# Altium schematic sheet Master.SchDoc: QUTMS Shutdown V2 - Master
size A3; Organization: QUT Motorsport; Address1: O-120; Address2: O Block; Address3: QUT Gardnes Point; Address4: Brisbane, 4000; DocumentNumber: 1; SheetNumber: 1; SheetTotal: 13
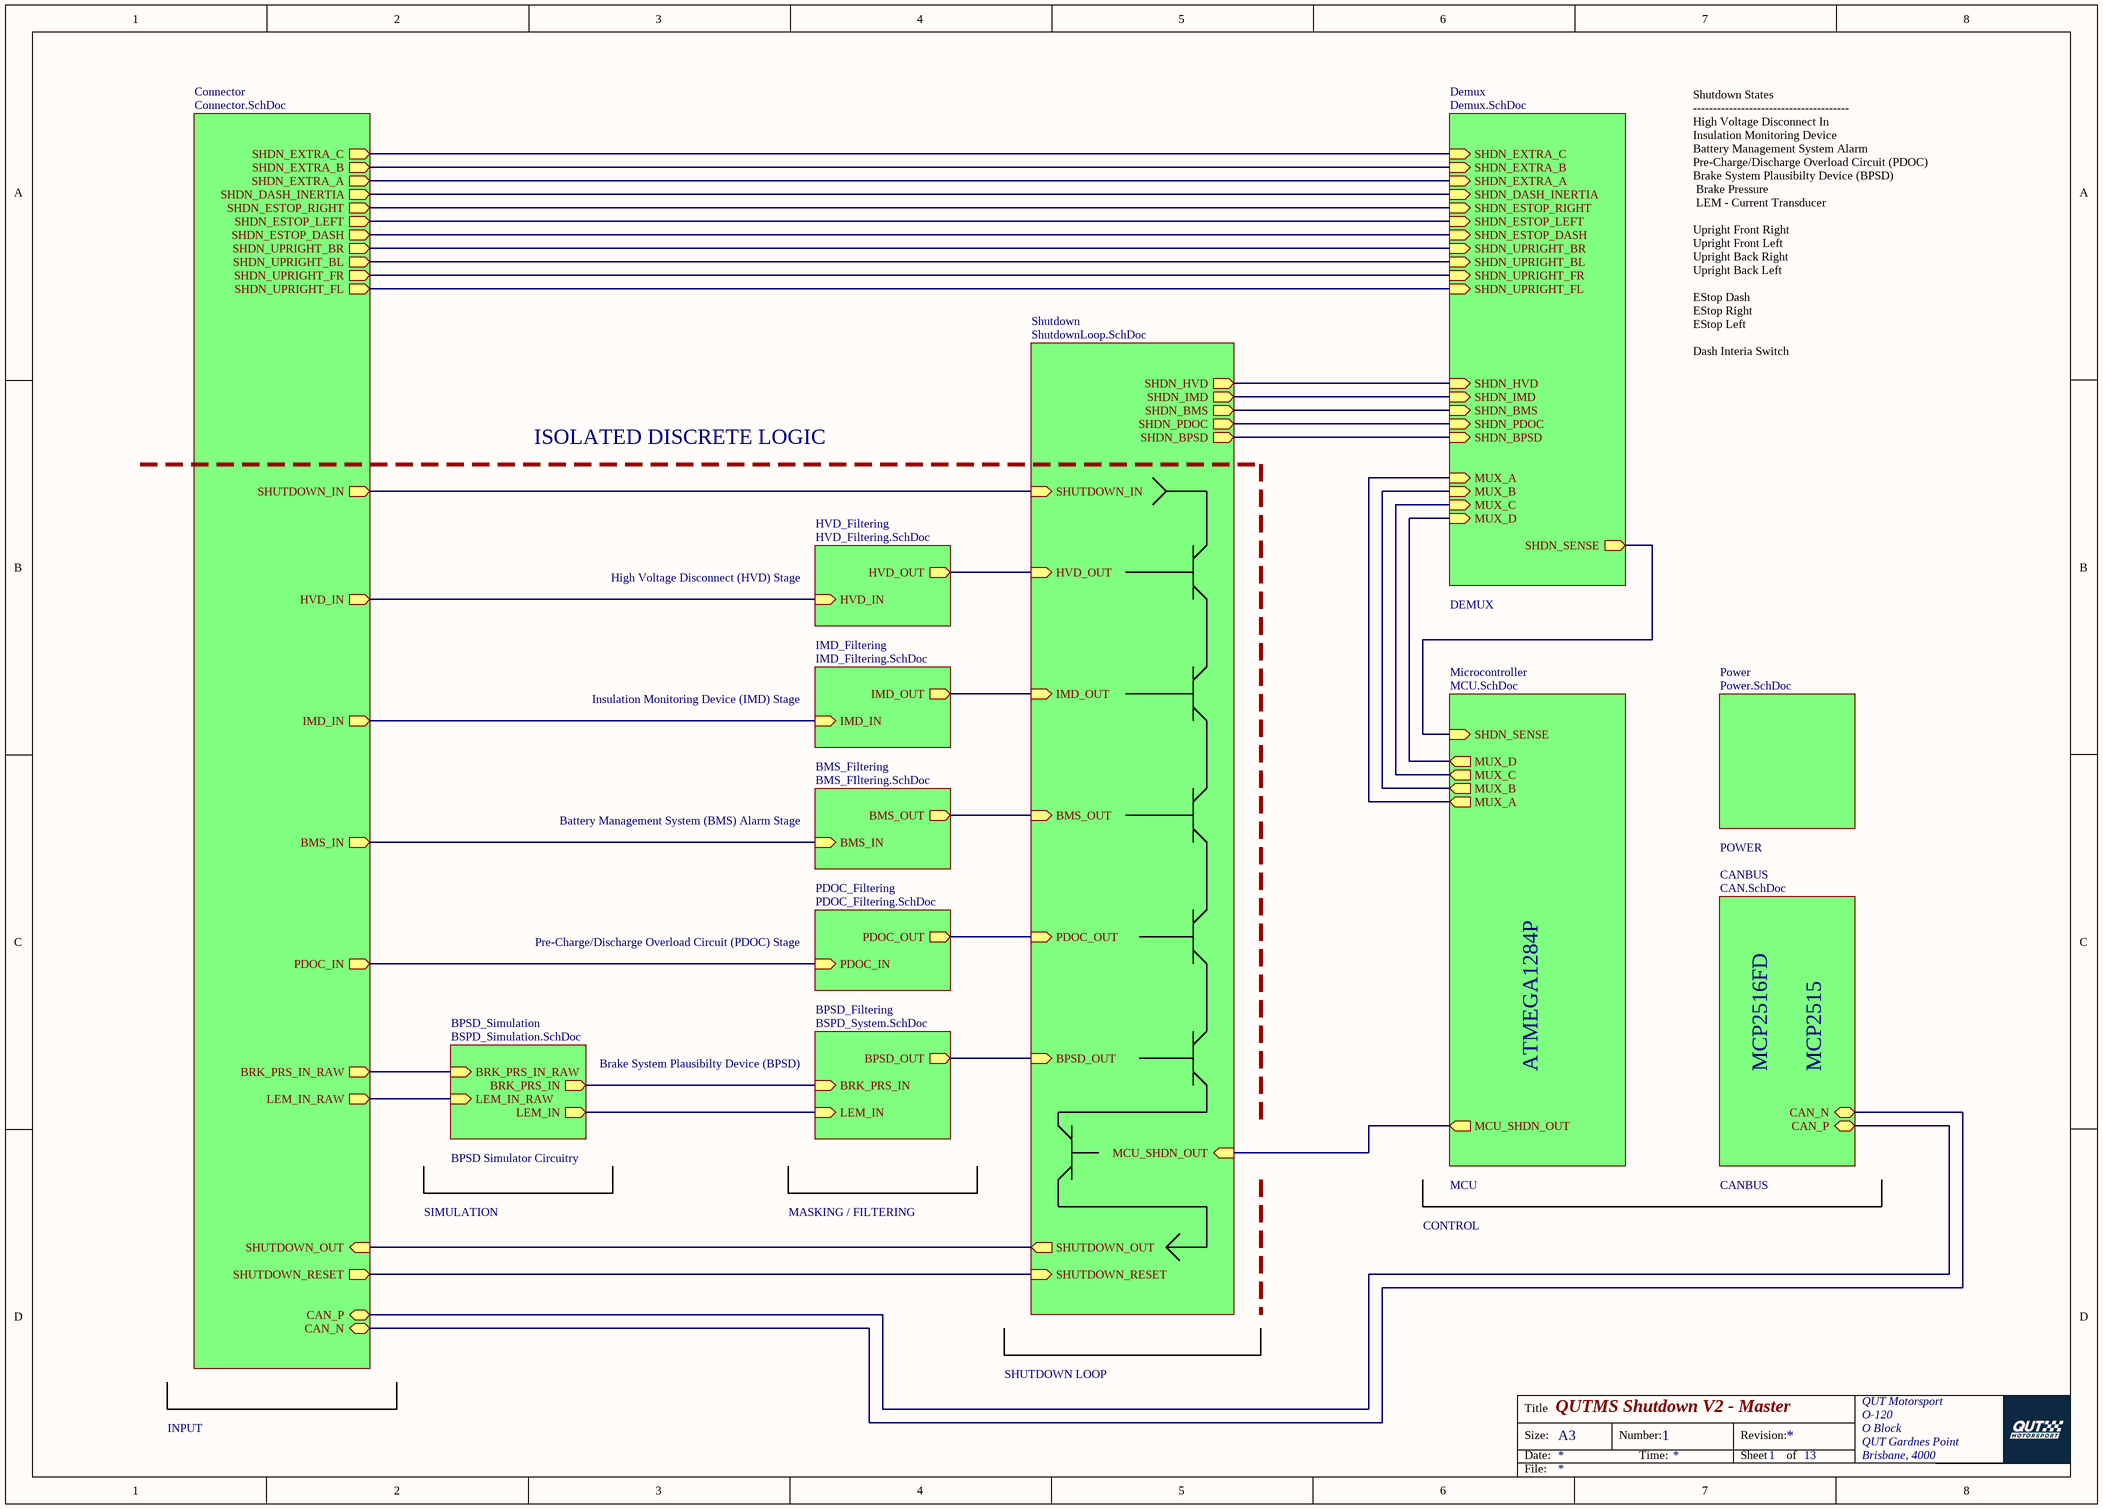
[diagram p0: Master.SchDoc]

## Sub-sheets
BMS_Filtering = BMS_FIltering.SchDoc: BMS_OUT (out), BMS_IN (in)
BPSD_Filtering = BSPD_System.SchDoc: BPSD_OUT (out), BRK_PRS_IN (in), LEM_IN (in)
BPSD_Simulation = BSPD_Simulation.SchDoc: LEM_IN (out), BRK_PRS_IN (out), BRK_PRS_IN_RAW (in), LEM_IN_RAW (in)
CANBUS = CAN.SchDoc: CAN_P (bidir), CAN_N (bidir)
Connector = Connector.SchDoc: LEM_IN_RAW (out), BRK_PRS_IN_RAW (out), PDOC_IN (out), BMS_IN (out), IMD_IN (out), HVD_IN (out), SHUTDOWN_IN (out), SHUTDOWN_OUT (in), SHUTDOWN_RESET (out), SHDN_UPRIGHT_FL (out), SHDN_UPRIGHT_FR (out), SHDN_UPRIGHT_BL (out), SHDN_UPRIGHT_BR (out), SHDN_ESTOP_LEFT (out), SHDN_ESTOP_RIGHT (out), SHDN_DASH_INERTIA (out), SHDN_EXTRA_B (out), SHDN_EXTRA_A (out), SHDN_ESTOP_DASH (out), SHDN_EXTRA_C (out), CAN_N (bidir), CAN_P (bidir)
Demux = Demux.SchDoc: SHDN_EXTRA_C (in), SHDN_EXTRA_B (in), SHDN_EXTRA_A (in), SHDN_DASH_INERTIA (in), SHDN_ESTOP_RIGHT (in), SHDN_ESTOP_LEFT (in), SHDN_ESTOP_DASH (in), SHDN_UPRIGHT_BR (in), SHDN_UPRIGHT_BL (in), SHDN_UPRIGHT_FR (in), SHDN_UPRIGHT_FL (in), SHDN_HVD (in), SHDN_IMD (in), SHDN_BMS (in), SHDN_PDOC (in), SHDN_BPSD (in), SHDN_SENSE (out), MUX_D (in), MUX_C (in), MUX_B (in), MUX_A (in)
HVD_Filtering = HVD_Filtering.SchDoc: HVD_OUT (out), HVD_IN (in)
IMD_Filtering = IMD_Filtering.SchDoc: IMD_OUT (out), IMD_IN (in)
Microcontroller = MCU.SchDoc: SHDN_SENSE (in), MUX_D (out), MUX_C (out), MUX_B (out), MUX_A (out), MCU_SHDN_OUT (out)
PDOC_Filtering = PDOC_Filtering.SchDoc: PDOC_OUT (out), PDOC_IN (in)
Power = Power.SchDoc: no entries
Shutdown = ShutdownLoop.SchDoc: HVD_OUT (in), IMD_OUT (in), BMS_OUT (in), PDOC_OUT (in), BPSD_OUT (in), SHUTDOWN_IN (in), SHUTDOWN_OUT (out), SHUTDOWN_RESET (in), SHDN_HVD (out), SHDN_IMD (out), SHDN_BMS (out), SHDN_PDOC (out), SHDN_BPSD (out), MCU_SHDN_OUT (in)

## Nets
(unnamed): sheet HVD_Filtering/HVD_OUT, sheet Shutdown/HVD_OUT
(unnamed): sheet HVD_Filtering/HVD_IN, sheet Connector/HVD_IN
(unnamed): sheet IMD_Filtering/IMD_OUT, sheet Shutdown/IMD_OUT
(unnamed): sheet IMD_Filtering/IMD_IN, sheet Connector/IMD_IN
(unnamed): sheet BMS_Filtering/BMS_OUT, sheet Shutdown/BMS_OUT
(unnamed): sheet BMS_Filtering/BMS_IN, sheet Connector/BMS_IN
(unnamed): sheet PDOC_Filtering/PDOC_OUT, sheet Shutdown/PDOC_OUT
(unnamed): sheet PDOC_Filtering/PDOC_IN, sheet Connector/PDOC_IN
(unnamed): sheet BPSD_Filtering/BPSD_OUT, sheet Shutdown/BPSD_OUT
(unnamed): sheet BPSD_Filtering/BRK_PRS_IN, sheet BPSD_Simulation/BRK_PRS_IN
(unnamed): sheet BPSD_Filtering/LEM_IN, sheet BPSD_Simulation/LEM_IN
(unnamed): sheet BPSD_Simulation/BRK_PRS_IN_RAW, sheet Connector/BRK_PRS_IN_RAW
(unnamed): sheet BPSD_Simulation/LEM_IN_RAW, sheet Connector/LEM_IN_RAW
(unnamed): sheet Connector/SHUTDOWN_IN, sheet Shutdown/SHUTDOWN_IN
(unnamed): sheet Connector/SHUTDOWN_OUT, sheet Shutdown/SHUTDOWN_OUT
(unnamed): sheet Connector/SHUTDOWN_RESET, sheet Shutdown/SHUTDOWN_RESET
(unnamed): sheet Connector/SHDN_UPRIGHT_FL, sheet Demux/SHDN_UPRIGHT_FL
(unnamed): sheet Connector/SHDN_UPRIGHT_FR, sheet Demux/SHDN_UPRIGHT_FR
(unnamed): sheet Connector/SHDN_UPRIGHT_BL, sheet Demux/SHDN_UPRIGHT_BL
(unnamed): sheet Connector/SHDN_UPRIGHT_BR, sheet Demux/SHDN_UPRIGHT_BR
(unnamed): sheet Connector/SHDN_ESTOP_LEFT, sheet Demux/SHDN_ESTOP_LEFT
(unnamed): sheet Connector/SHDN_ESTOP_RIGHT, sheet Demux/SHDN_ESTOP_RIGHT
(unnamed): sheet Connector/SHDN_DASH_INERTIA, sheet Demux/SHDN_DASH_INERTIA
(unnamed): sheet Connector/SHDN_EXTRA_B, sheet Demux/SHDN_EXTRA_B
(unnamed): sheet Connector/SHDN_EXTRA_A, sheet Demux/SHDN_EXTRA_A
(unnamed): sheet Connector/SHDN_ESTOP_DASH, sheet Demux/SHDN_ESTOP_DASH
(unnamed): sheet Connector/SHDN_EXTRA_C, sheet Demux/SHDN_EXTRA_C
(unnamed): sheet Connector/CAN_N, sheet CANBUS/CAN_N
(unnamed): sheet Connector/CAN_P, sheet CANBUS/CAN_P
(unnamed): sheet Shutdown/SHDN_HVD, sheet Demux/SHDN_HVD
(unnamed): sheet Shutdown/SHDN_IMD, sheet Demux/SHDN_IMD
(unnamed): sheet Shutdown/SHDN_BMS, sheet Demux/SHDN_BMS
(unnamed): sheet Shutdown/SHDN_PDOC, sheet Demux/SHDN_PDOC
(unnamed): sheet Shutdown/SHDN_BPSD, sheet Demux/SHDN_BPSD
(unnamed): sheet Shutdown/MCU_SHDN_OUT, sheet Microcontroller/MCU_SHDN_OUT
(unnamed): sheet Microcontroller/SHDN_SENSE, sheet Demux/SHDN_SENSE
(unnamed): sheet Microcontroller/MUX_D, sheet Demux/MUX_D
(unnamed): sheet Microcontroller/MUX_C, sheet Demux/MUX_C
(unnamed): sheet Microcontroller/MUX_B, sheet Demux/MUX_B
(unnamed): sheet Microcontroller/MUX_A, sheet Demux/MUX_A

## Notes on the sheet
- Shutdown States
  ---------------------------------------
  High Voltage Disconnect In
  Insulation Monitoring Device
  Battery Management System Alarm
  Pre-Charge/Discharge Overload Circuit (PDOC)
  Brake System Plausibilty Device (BPSD)
  Brake Pressure
  LEM - Current Transducer
  Upright Front Right
  Upright Front Left
  Upright Back Right
  Upright Back Left
  EStop Dash
  EStop Right
  EStop Left
  Dash Interia Switch
- ISOLATED DISCRETE LOGIC
- High Voltage Disconnect (HVD) Stage
- DEMUX
- Insulation Monitoring Device (IMD) Stage
- Battery Management System (BMS) Alarm Stage
- POWER
- Pre-Charge/Discharge Overload Circuit (PDOC) Stage
- Brake System Plausibilty Device (BPSD)
- ATMEGA1284P
- MCP2516FD
- MCP2515
- BPSD Simulator Circuitry
- MCU
- CANBUS
- SIMULATION
- MASKING / FILTERING
- CONTROL
- SHUTDOWN LOOP
- INPUT
- Title
- Size:
- Date:
- A3
- Number:
- Time:
- Revision:
- Sheet
- of
- File: